# Altium schematic sheet SmartToy Main Board REV02 Schematic.SchDoc: Smart Toy Main Board REV01 Schematic (part 3 of 3)
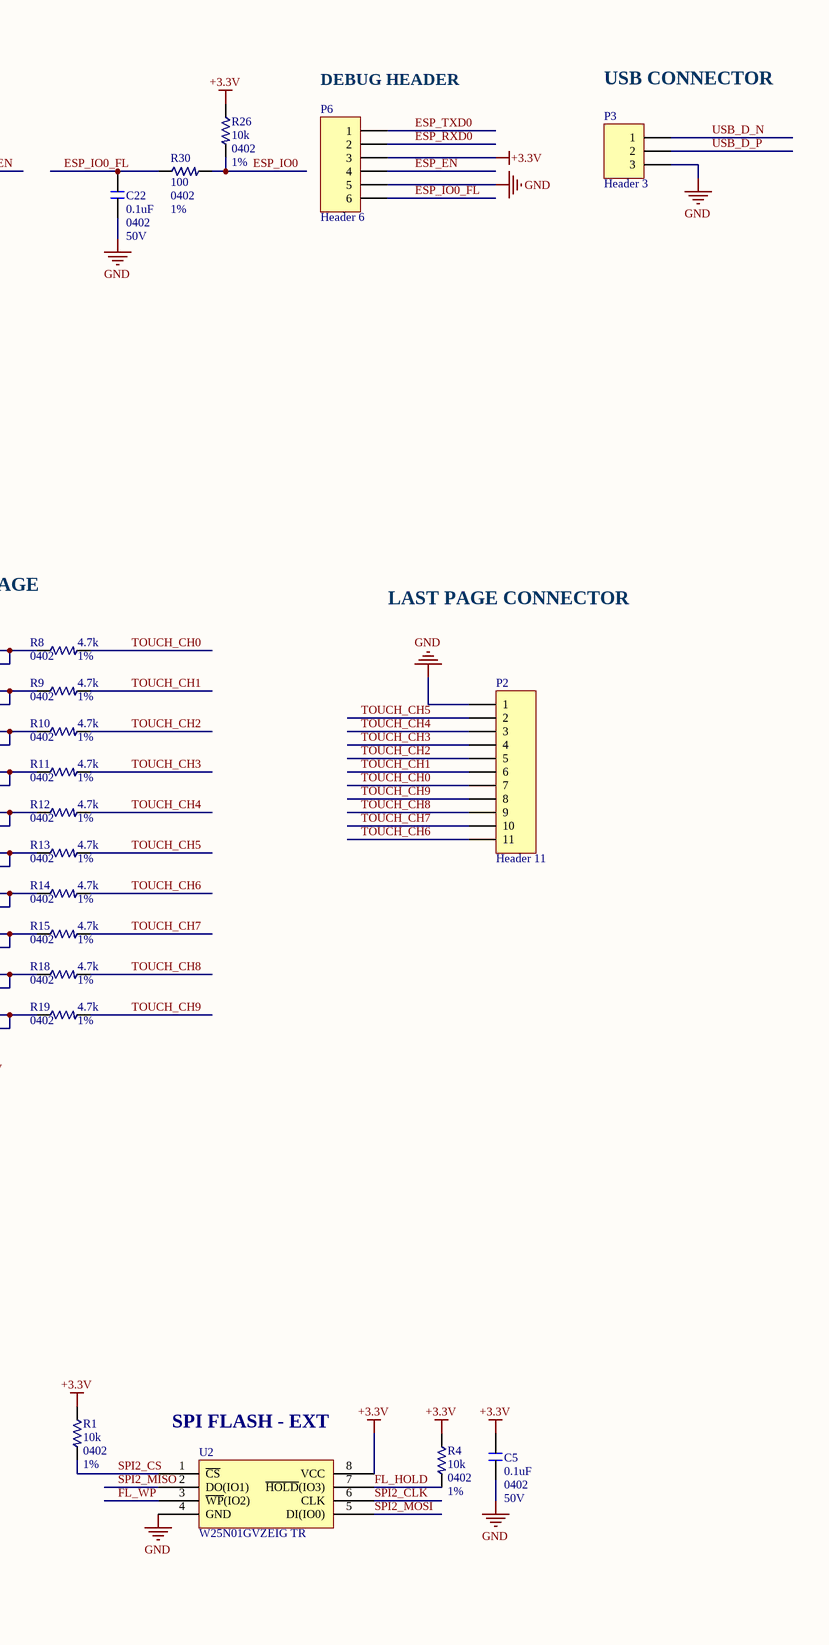
[diagram p3: SmartToy Main Board REV02 Schematic.SchDoc, right]

## Library data of the parts (continued)
R29 R33 = RES_SMD: YAGEO - RC0402FR-0727RL - Résistance à puce CMS, Couche épaisse, 0402 [1005 Metric], 27 ohm, Série RC, 50 V, Couche épaisse; Mouting Technology: SMT; Tolerance: 1%; Power Rating: 62.5mW; Voltage Rating: 50V; Temperature Coefficient: 100ppm/°C; Max Power Dissipation: 63mW; Pin: 2; Supplier 1: Digi-Key; Supplier Part Number 1: YAG3086CT-ND; Manufacturer 1: Yageo; Manufacturer Part Number 1: RC0402FR-0727RL; RoHS: Yes; Category: Chip SMD Resistors; Stock 1: 378577; Pricing 1: 1=0.10000, 10=0.01600, 100=0.00660, 1000=0.00299, 2500=0.00259, 5000=0.00214 (USD); Case/Package: 0402; Case Code (Imperial): 0402; Case Code (Metric): 1005; Weight: 2.3E-05oz; Size Code: 0402; Min Operating Temperature: -55°C; Max Operating Temperature: 155°C; Resistance: 27R; Packaging: Tape and Reel; Resistor Type: Thick Film; Termination: SMD/SMT; Number of Terminations: 2; Features: Moisture Resistant; Series: RC; Construction: Rectangular; Technology: THICK FILM; Resistance Tolerance: 1%; Length: 1mm; Width: 0.5mm; Height: 0.016inch; Depth: 0.5mm; REACH SVHC: Unknown; Military Standard: Not; Lead Free: Lead Free; RoHS Compliant: Yes; ComponentLink1URL: https://datasheet.ciiva.com/11808/0900766b80c66297-11808450.pdf?src-supplier=RSComponents; ComponentLink1Description: https://datasheet.ciiva.com/11808/0900766b80c66297-11808450.pdf?src-supplier=RSComponents; ComponentLink2URL: https://datasheet.ciiva.com/7849/1018594-7849926.pdf?src-supplier=Element14; ComponentLink2Description: https://datasheet.ciiva.com/7849/1018594-7849926.pdf?src-supplier=Element14; ComponentLink3URL: https://datasheet.ciiva.com/7849/1018594-7849927.pdf?src-supplier=Element14; ComponentLink3Description: https://datasheet.ciiva.com/7849/1018594-7849927.pdf?src-supplier=Element14; ComponentLink4URL: https://datasheet.ciiva.com/17044/pyu-rc0402-51-rohs-l-6-17044345.pdf?src-supplier=Future+Electronics; ComponentLink4Description: https://datasheet.ciiva.com/17044/pyu-rc0402-51-rohs-l-6-17044345.pdf?src-supplier=Future+Electronics; ComponentLink5URL: https://datasheet.ciiva.com/15189/getdatasheetpartid-327852-15189402.pdf?src-supplier=Verical; ComponentLink5Description: https://datasheet.ciiva.com/15189/getdatasheetpartid-327852-15189402.pdf?src-supplier=Verical
R30 R31 = RES_SMD: RES SMD 100 OHM 5% 1/16W 0402; Manufacturer: Yageo; Manufacturer Part Number: RC0402FR-07100RL; Power Rating: 62.5mW; Voltage Rating: 50V; Resistance: 100R; Temperature Coefficient: 100ppm/°C; ComponentLink1URL: https://datasheet.ciiva.com/7850/1018594-7850134.pdf?src-supplier=Element14; ComponentLink1Description: https://datasheet.ciiva.com/7850/1018594-7850134.pdf?src-supplier=Element14; ComponentLink2URL: https://datasheet.ciiva.com/7850/1018594-7850135.pdf?src-supplier=Element14; ComponentLink2Description: https://datasheet.ciiva.com/7850/1018594-7850135.pdf?src-supplier=Element14; ComponentLink3URL: https://datasheet.ciiva.com/2452/pyu-r-int-thick-7-2452617.pdf?src-supplier=Digi-Key; ComponentLink3Description: https://datasheet.ciiva.com/2452/pyu-r-int-thick-7-2452617.pdf?src-supplier=Digi-Key; ComponentLink4URL: https://datasheet.ciiva.com/2452/pyu-r-int-thick-7-2452618.pdf?src-supplier=Digi-Key; ComponentLink4Description: https://datasheet.ciiva.com/2452/pyu-r-int-thick-7-2452618.pdf?src-supplier=Digi-Key; ComponentLink5URL: https://datasheet.ciiva.com/2452/pyu-r-int-thick-7-2452619.pdf?src-supplier=Digi-Key; ComponentLink5Description: https://datasheet.ciiva.com/2452/pyu-r-int-thick-7-2452619.pdf?src-supplier=Digi-Key; ComponentLink6URL: https://datasheet.ciiva.com/16740/pyu-rc0402-51-rohs-l-6-r-16740924.pdf?src-supplier=Future+Electronics; ComponentLink6Description: https://datasheet.ciiva.com/16740/pyu-rc0402-51-rohs-l-6-r-16740924.pdf?src-supplier=Future+Electronics; ComponentLink7URL: https://datasheet.ciiva.com/12577/pyu-rc0402-51-rohs-l-6-r-12577725.pdf?src-supplier=Mouser; ComponentLink7Description: https://datasheet.ciiva.com/12577/pyu-rc0402-51-rohs-l-6-r-12577725.pdf?src-supplier=Mouser; ComponentLink8URL: https://datasheet.ciiva.com/46394/1018594-46394943.pdf?src-supplier=Element14; ComponentLink8Description: https://datasheet.ciiva.com/46394/1018594-46394943.pdf?src-supplier=Element14; Supplier 1: Digi-Key; Supplier Part Number 1: 311-100LRCT-ND; Stock 1: 18149776; Pricing 1: 1 = 0.10000, 10 = 0.01400, 100 = 0.00580, 1000 = 0.00260, 2500 = 0.00226, 5000 = 0.00186 (USD); RoHS: Yes; Case/Package: 0402; Number of Pins: 2; Case Code (Metric): 1005; Min Operating Temperature: -55°C; Max Operating Temperature: 155°C; Voltage Rating (DC): 50V; Packaging: Tape and Reel; Termination: SMD/SMT; Resistor Type: Thick Film; Length: 1mm; Width: 0.5mm; Height: 0.32mm; Depth: 0.5mm; REACH SVHC: No SVHC; Military Standard: Not; Lead Free: Lead Free; ComponentLink9URL: https://datasheet.ciiva.com/7849/1784430-7849810.pdf?src-supplier=Element14; ComponentLink9Description: https://datasheet.ciiva.com/7849/1784430-7849810.pdf?src-supplier=Element14; ComponentLink10URL: https://datasheet.ciiva.com/11808/0900766b80c66297-11808765.pdf?src-supplier=RSComponents; ComponentLink10Description: https://datasheet.ciiva.com/11808/0900766b80c66297-11808765.pdf?src-supplier=RSComponents; ComponentLink11URL: https://datasheet.ciiva.com/12667/pyu-rc0402-51-rohs-l-6-r-12667957.pdf?src-supplier=Mouser; ComponentLink11Description: https://datasheet.ciiva.com/12667/pyu-rc0402-51-rohs-l-6-r-12667957.pdf?src-supplier=Mouser; ComponentLink12URL: https://datasheet.ciiva.com/16740/pyu-rc0402-51-rohs-l-6-r-16740566.pdf?src-supplier=Future+Electronics; ComponentLink12Description: https://datasheet.ciiva.com/16740/pyu-rc0402-51-rohs-l-6-r-16740566.pdf?src-supplier=Future+Electronics; ComponentLink13URL: https://datasheet.ciiva.com/15189/getdatasheetpartid-329466-15189335.pdf?src-supplier=Verical; ComponentLink13Description: https://datasheet.ciiva.com/15189/getdatasheetpartid-329466-15189335.pdf?src-supplier=Verical; ComponentLink14URL: https://datasheet.ciiva.com/22747/1018594-22747511.pdf?src-supplier=Element14; ComponentLink14Description: https://datasheet.ciiva.com/22747/1018594-22747511.pdf?src-supplier=Element14; ComponentLink15URL: https://datasheet.ciiva.com/28367/1018594-28367226.pdf?src-supplier=Element14; ComponentLink15Description: https://datasheet.ciiva.com/28367/1018594-28367226.pdf?src-supplier=Element14
R46 = RES_SMD: YAGEO (PHYCOMP) - RC0603FR-07330RL - RES, THICK FILM, 330R, 1%, 0.1W, 0603; Mouting Technology: SMT; Temperature Coefficient: 100ppm/°C; Voltage Rating (DC): 50V; Power Rating: 100mW; Pin: 2; Supplier 1: Digi-Key; Supplier Part Number 1: 311-330HRCT-ND; Manufacturer 1: Yageo; Manufacturer Part Number 1: RC0603FR-07330RL; RoHS: Yes; Category: Chip SMD Resistors; Stock 1: 1325793; Pricing 1: 1=0.10000, 10=0.02400, 100=0.00970, 1000=0.00436, 2500=0.00378 (USD); Number of Pins: 2; Case Code (Metric): 1608; Case Code (Imperial): 0603; Size Code: 0603; Min Operating Temperature: -55°C; Max Operating Temperature: 155°C; Resistance: 330R; Resistor Type: Thick Film; Packaging: Tape and Reel; Voltage Rating: 50V; Package Quantity: 1; Number of Terminations: 2; Termination: SMD/SMT; Max Power Dissipation: 100mW; Features: Moisture Resistant; Series: RC; Resistance Tolerance: 1%; Technology: THICK FILM; Length: 1.6mm; Width: 0.8mm; Height: 0.45mm; Depth: 0.8mm; REACH SVHC: No SVHC; Lead Free: Lead Free; RoHS Compliant: Yes; ComponentLink1URL: https://datasheet.ciiva.com/11819/0900766b80f96399-11819327.pdf?src-supplier=RSComponents; ComponentLink1Description: https://datasheet.ciiva.com/11819/0900766b80f96399-11819327.pdf?src-supplier=RSComponents; ComponentLink2URL: https://datasheet.ciiva.com/2454/pyu-r-int-thick-7-2454864.pdf?src-supplier=Digi-Key; ComponentLink2Description: https://datasheet.ciiva.com/2454/pyu-r-int-thick-7-2454864.pdf?src-supplier=Digi-Key; ComponentLink3URL: https://datasheet.ciiva.com/2454/pyu-r-int-thick-7-2454865.pdf?src-supplier=Digi-Key; ComponentLink3Description: https://datasheet.ciiva.com/2454/pyu-r-int-thick-7-2454865.pdf?src-supplier=Digi-Key; ComponentLink4URL: https://datasheet.ciiva.com/2454/pyu-r-int-thick-7-2454866.pdf?src-supplier=Digi-Key; ComponentLink4Description: https://datasheet.ciiva.com/2454/pyu-r-int-thick-7-2454866.pdf?src-supplier=Digi-Key; ComponentLink5URL: https://datasheet.ciiva.com/12555/rc0603-272842-12555334.pdf?src-supplier=Mouser; ComponentLink5Description: https://datasheet.ciiva.com/12555/rc0603-272842-12555334.pdf?src-supplier=Mouser; ComponentLink6URL: https://datasheet.ciiva.com/46440/1868787-46440904.pdf?src-supplier=Element14; ComponentLink6Description: https://datasheet.ciiva.com/46440/1868787-46440904.pdf?src-supplier=Element14; ComponentLink7URL: https://datasheet.ciiva.com/7746/443971-7746329.pdf?src-supplier=Element14; ComponentLink7Description: https://datasheet.ciiva.com/7746/443971-7746329.pdf?src-supplier=Element14; ComponentLink8URL: https://datasheet.ciiva.com/7746/443971-7746330.pdf?src-supplier=Element14; ComponentLink8Description: https://datasheet.ciiva.com/7746/443971-7746330.pdf?src-supplier=Element14; ComponentLink9URL: https://datasheet.ciiva.com/7746/1686128-7746331.pdf?src-supplier=Element14; ComponentLink9Description: https://datasheet.ciiva.com/7746/1686128-7746331.pdf?src-supplier=Element14
R55 = RES_SMD: RES SMD 499 OHM 5% 1/16W 0402; Manufacturer 1: Yageo; Manufacturer Part Number 1: RC0402FR-07499RL; Mouting Technology: SMT; Resistance: 499R; Power Rating: 62.5mW; Voltage Rating: 50V; Max Power Dissipation: 63mW; Temperature Coefficient: 100ppm/°C; Pin: 2; Supplier 1: Digi-Key; Supplier Part Number 1: 311-499LRCT-ND; RoHS: Yes; Category: Chip SMD Resistors; Stock 1: 2245904; Pricing 1: 1=0.10000, 10=0.01600, 100=0.00660, 1000=0.00299, 2500=0.00259, 5000=0.00214 (USD); Case/Package: 0402; Case Code (Metric): 1005; Size Code: 0402; Min Operating Temperature: -55°C; Max Operating Temperature: 155°C; Tolerance: 1%; Package Quantity: 1; Packaging: Tape and Reel; Resistor Type: Thick Film; Number of Terminations: 2; Termination: SMD/SMT; Voltage Rating (DC): 50V; Features: Moisture Resistant; Series: RC; Construction: Rectangular; Length: 1mm; Width: 0.02inch; Height: 0.016inch; Depth: 0.5mm; RoHS Compliant: Yes; REACH SVHC: No SVHC; Military Standard: Not; Lead Free: Lead Free; ComponentLink1URL: https://datasheet.ciiva.com/2453/pyu-r-int-thick-7-2453538.pdf?src-supplier=Digi-Key; ComponentLink1Description: https://datasheet.ciiva.com/2453/pyu-r-int-thick-7-2453538.pdf?src-supplier=Digi-Key; ComponentLink2URL: https://datasheet.ciiva.com/2453/pyu-r-int-thick-7-2453539.pdf?src-supplier=Digi-Key; ComponentLink2Description: https://datasheet.ciiva.com/2453/pyu-r-int-thick-7-2453539.pdf?src-supplier=Digi-Key; ComponentLink3URL: https://datasheet.ciiva.com/2453/pyu-r-int-thick-7-2453540.pdf?src-supplier=Digi-Key; ComponentLink3Description: https://datasheet.ciiva.com/2453/pyu-r-int-thick-7-2453540.pdf?src-supplier=Digi-Key
R56-R60 = RES_SMD: RES SMD 0 OHM JUMPER 1/16W 0402; Manufacturer 1: Yageo; Manufacturer Part Number 1: RC0402FR-070RL; Mouting Technology: SMT; Resistance: 0R; Tolerance: 1%; Power Rating: 62.5mW; Voltage Rating: 50V; Temperature Coefficient: 200ppm/°C; Max Power Dissipation: 63mW; Pin: 2; Supplier 1: Mouser; Supplier Part Number 1: 603-RC0402FR-070RL; RoHS: Yes; Category: Chip SMD Resistors; Stock 1: 204375; Pricing 1: 1=0.10000, 10=0.01000, 50=0.01000, 100=0.00400, 1000=0.00300, 10000=0.00200 (USD); Mount: Surface Mount; Case/Package: 0402; Contact Plating: Tin,Matte; Case Code (Imperial): 0402; Case Code (Metric): 1005; Size Code: 0402; Min Operating Temperature: -55°C; Max Operating Temperature: 155°C; Resistor Type: Thick Film; Packaging: Tape and Reel; Termination: SMD/SMT; Features: Moisture Resistant; Series: RC; Number of Terminations: 2; Length: 1mm; Width: 0.5mm; Height: 0.35mm; Radiation Hardening: No; Lead Free: Lead Free; RoHS Compliant: Yes; ComponentLink1URL: https://datasheet.ciiva.com/8896/pyu-rc0402-51-rohs-l-6-8896149.pdf?src-supplier=Avnet; ComponentLink1Description: https://datasheet.ciiva.com/8896/pyu-rc0402-51-rohs-l-6-8896149.pdf?src-supplier=Avnet; ComponentLink2URL: https://datasheet.ciiva.com/16790/pyu-rc0402-51-rohs-l-6-r-16790444.pdf?src-supplier=Future+Electronics; ComponentLink2Description: https://datasheet.ciiva.com/16790/pyu-rc0402-51-rohs-l-6-r-16790444.pdf?src-supplier=Future+Electronics; ComponentLink3URL: https://datasheet.ciiva.com/28419/pyu-rc0402-51-rohs-l-6-28419661.pdf?src-supplier=Avnet+Europe; ComponentLink3Description: https://datasheet.ciiva.com/28419/pyu-rc0402-51-rohs-l-6-28419661.pdf?src-supplier=Avnet+Europe; ComponentLink4URL: https://datasheet.ciiva.com/16869/pyu-rc0402-51-rohs-l-6-16869518.pdf?src-supplier=Avnet+Europe; ComponentLink4Description: https://datasheet.ciiva.com/16869/pyu-rc0402-51-rohs-l-6-16869518.pdf?src-supplier=Avnet+Europe
U1 = MIC2875-AYMT-T5: IC REG BOOST ADJ 3.8A 8TDFN; Manufacturer 1: Microchip; Supplier 1: Digi-Key; Manufacturer Part Number 1: MIC2875-AYMT-T5; RoHS: No; Category: Voltage Regulators - Switching; Stock 1: 322; Pricing 1: 1=1.27000, 25=1.05000, 100=0.96000 (USD); ComponentLink1URL: http://www.microchip.com/mymicrochip/filehandler.aspx?ddocname=en580778&src-supplier=Digi-Key; ComponentLink1Description: http://www.microchip.com/mymicrochip/filehandler.aspx?ddocname=en580778&src-supplier=Digi-Key; Supplier Part Number 1: 576-4863-1-ND
U2 = W25N01GVZEIG TR: IC FLASH 1G SPI 104MHZ 8WSON; Manufacturer 1: Winbond; Memory Type: FLASH,NAND; Interface: SPI,Serial; Supplier 1: Digi-Key; Manufacturer Part Number 1: W25N01GVZEIG TR; RoHS: Yes; Category: Memory; Stock 1: 33713; Pricing 1: 1=3.21000, 10=2.88200, 25=2.83760, 50=2.83000, 100=2.52870, 250=2.44564, 500=2.43672, 1000=2.26904 (USD); Min Operating Temperature: -40°C; Max Operating Temperature: 85°C; Packaging: Tape and Reel; Frequency: 104MHz; RoHS Compliant: Yes; ComponentLink1URL: http://www.winbond.com/resource-files/w25n01gv%20revl%20050918%20unsecured.pdf?src-supplier=Digi-Key; ComponentLink1Description: http://www.winbond.com/resource-files/w25n01gv%20revl%20050918%20unsecured.pdf?src-supplier=Digi-Key; Supplier Part Number 1: W25N01GVZEIGCT-ND
U3 = ESP32-S2: RF System on a Chip - SoC SMD Wi-Fi IC, ESP32-S2, singal-core MCU, QFN 56-pin, 7*7 mm; Manufacturer 1: Espressif Systems; Manufacturer Part Number 1: ESP32-S2
U4 = AT42QT1110-MUR: Capacitive Touch Screen 11 Key 32-Pin VQFN EP T/R; Manufacturer 1: Microchip; Supplier 1: Digi-Key; Manufacturer Part Number 1: AT42QT1110-MUR; RoHS: No; Stock 1: 4052; Pricing 1: 1=1.16000, 25=1.06000, 100=0.96200 (USD); ComponentLink1URL: http://www.microchip.com/mymicrochip/filehandler.aspx?ddocname=en590256&src-supplier=Digi-Key; ComponentLink1Description: http://www.microchip.com/mymicrochip/filehandler.aspx?ddocname=en590256&src-supplier=Digi-Key; Supplier Part Number 1: AT42QT1110-MURCT-ND
U5 = W25N01GVZEIG TR: IC FLASH 128MBIT SPI/QUAD 8SOIC; Manufacturer 1: Winbond; Memory Type: Non-Volatile,FLASH; Memory Size: 128Mb; Frequency: 133MHz; ComponentLink1URL: http://www.winbond.com/resource-files/w25n01gv%20revl%20050918%20unsecured.pdf?src-supplier=Digi-Key; ComponentLink1Description: http://www.winbond.com/resource-files/w25n01gv%20revl%20050918%20unsecured.pdf?src-supplier=Digi-Key; Supplier 1: Digi-Key; Supplier Part Number 1: W25Q128JVSIM-ND; Manufacturer Part Number 1: W25Q128JVSIM; RoHS: Yes; Category: Memory; Stock 1: 4617; Pricing 1: 1=1.62000, 10=1.48100, 25=1.44080, 50=1.43360, 100=1.28140, 250=1.27772, 500=1.25844, 1000=1.20501, 5000=1.12190 (USD); Mount: Surface Mount; Case/Package: SOIC; Min Operating Temperature: -40°C; Max Operating Temperature: 85°C; Packaging: Rail/Tube; RoHS Compliant: Yes; ComponentLink2URL: http://www.winbond.com/resource-files/w25q128jv_dtr%20revc%2003272018%20plus.pdf?src-supplier=Digi-Key; ComponentLink2Description: http://www.winbond.com/resource-files/w25q128jv_dtr%20revc%2003272018%20plus.pdf?src-supplier=Digi-Key
U6 = AntenaIPX: CONN UMCC JACK STR 50OHM SMD; Manufacturer: TE Connectivity AMP; Body Material: Polymer,Liquid Crystal Polymer; Body Plating: Gold; Dielectric Material: Polymer; Impedance: 50R; Max Frequency: 6GHz; Gender: Female; Connector System: Cable-to-Board; Number of Positions: 1; Sealable: No (Without); Supplier 1: Digi-Key; Supplier Part Number 1: A118077CT-ND; Manufacturer Part Number: 1909763-1; Stock 1: 175154; Pricing 1: 1 = 0.46000, 10 = 0.42900, 25 = 0.38600, 50 = 0.34300, 100 = 0.32860, 250 = 0.30008, 500 = 0.28578, 1000 = 0.23577, 2500 = 0.21434 (USD); RoHS: Yes; Mount: Panel; Case/Package: SMD/SMT; Contact Plating: Gold; Contact Material: Copper Alloy; Housing Color: Beige; Insulation Material: Thermoplastic; Min Operating Temperature: -40°C; Max Operating Temperature: 194°C; Packaging: Tape and Reel; Package Quantity: 1; Fastening Type: Push,Pull; Termination: SMD/SMT; Connector Type: Jack; Orientation: Straight; Frequency: 6GHz; Length: 3mm; Radiation Hardening: No; ELV: Compliant; Lead Free: Lead Free; ComponentLink1URL: https://datasheet.ciiva.com/16312/eng-cd-1909763-b-16312469.pdf?src-supplier=Future+Electronics; ComponentLink1Description: https://datasheet.ciiva.com/16312/eng-cd-1909763-b-16312469.pdf?src-supplier=Future+Electronics; ComponentLink2URL: https://datasheet.ciiva.com/16469/eng-cd-1909763-b-16469221.pdf?src-supplier=Avnet+Asia; ComponentLink2Description: https://datasheet.ciiva.com/16469/eng-cd-1909763-b-16469221.pdf?src-supplier=Avnet+Asia; ComponentLink3URL: https://datasheet.ciiva.com/9423/eng-cd-1909763-b-9423785.pdf?src-supplier=Avnet; ComponentLink3Description: https://datasheet.ciiva.com/9423/eng-cd-1909763-b-9423785.pdf?src-supplier=Avnet; ComponentLink4URL: https://datasheet.ciiva.com/29191/eng-cd-1909763-b1-basefilename-29191146.pdf?src-supplier=Digi-Key; ComponentLink4Description: https://datasheet.ciiva.com/29191/eng-cd-1909763-b1-basefilename-29191146.pdf?src-supplier=Digi-Key; ComponentLink5URL: https://datasheet.ciiva.com/29191/eng-cd-1909763-b1-basefilename-29191148.pdf?src-supplier=Digi-Key; ComponentLink5Description: https://datasheet.ciiva.com/29191/eng-cd-1909763-b1-basefilename-29191148.pdf?src-supplier=Digi-Key
X1 = FA-128 32.0000MF10Z-AJ3: CRYSTAL 40.0000MHZ 8PF SMD; Manufacturer 1: Abracon; Manufacturer Part Number 1: ABM11W-40.0000MHZ-8-B1U-T3; Drain to Source Voltage (Vdss): 60V; Continuous Drain Current (ID): 22A; Rds On Max: 4mR; Input Capacitance: 2.2nF; Max Power Dissipation: 79W; Frequency Stability: 10ppm; ESR (Equivalent Series Resistance): 60R; Supplier 1: Digi-Key; Supplier Part Number 1: 535-13918-1-ND; RoHS: Yes; Stock 1: 770; Pricing 1: 1=0.78000, 10=0.69000, 50=0.64500, 100=0.57000, 500=0.54000 (USD); Mount: Surface Mount; Case/Package: DFN; Min Operating Temperature: -55°C; Max Operating Temperature: 175°C; Packaging: Cut Tape; Frequency: 40MHz; Frequency Tolerance: 10ppm; Load Capacitance: 8pF; ComponentLink1URL: https://abracon.com/Resonators/ABM11W.pdf?src-supplier=Digi-Key; ComponentLink1Description: https://abracon.com/Resonators/ABM11W.pdf?src-supplier=Digi-Key